# EAGLE schematic LampBoxV0.31-THT (EAGLE 9.6.2)
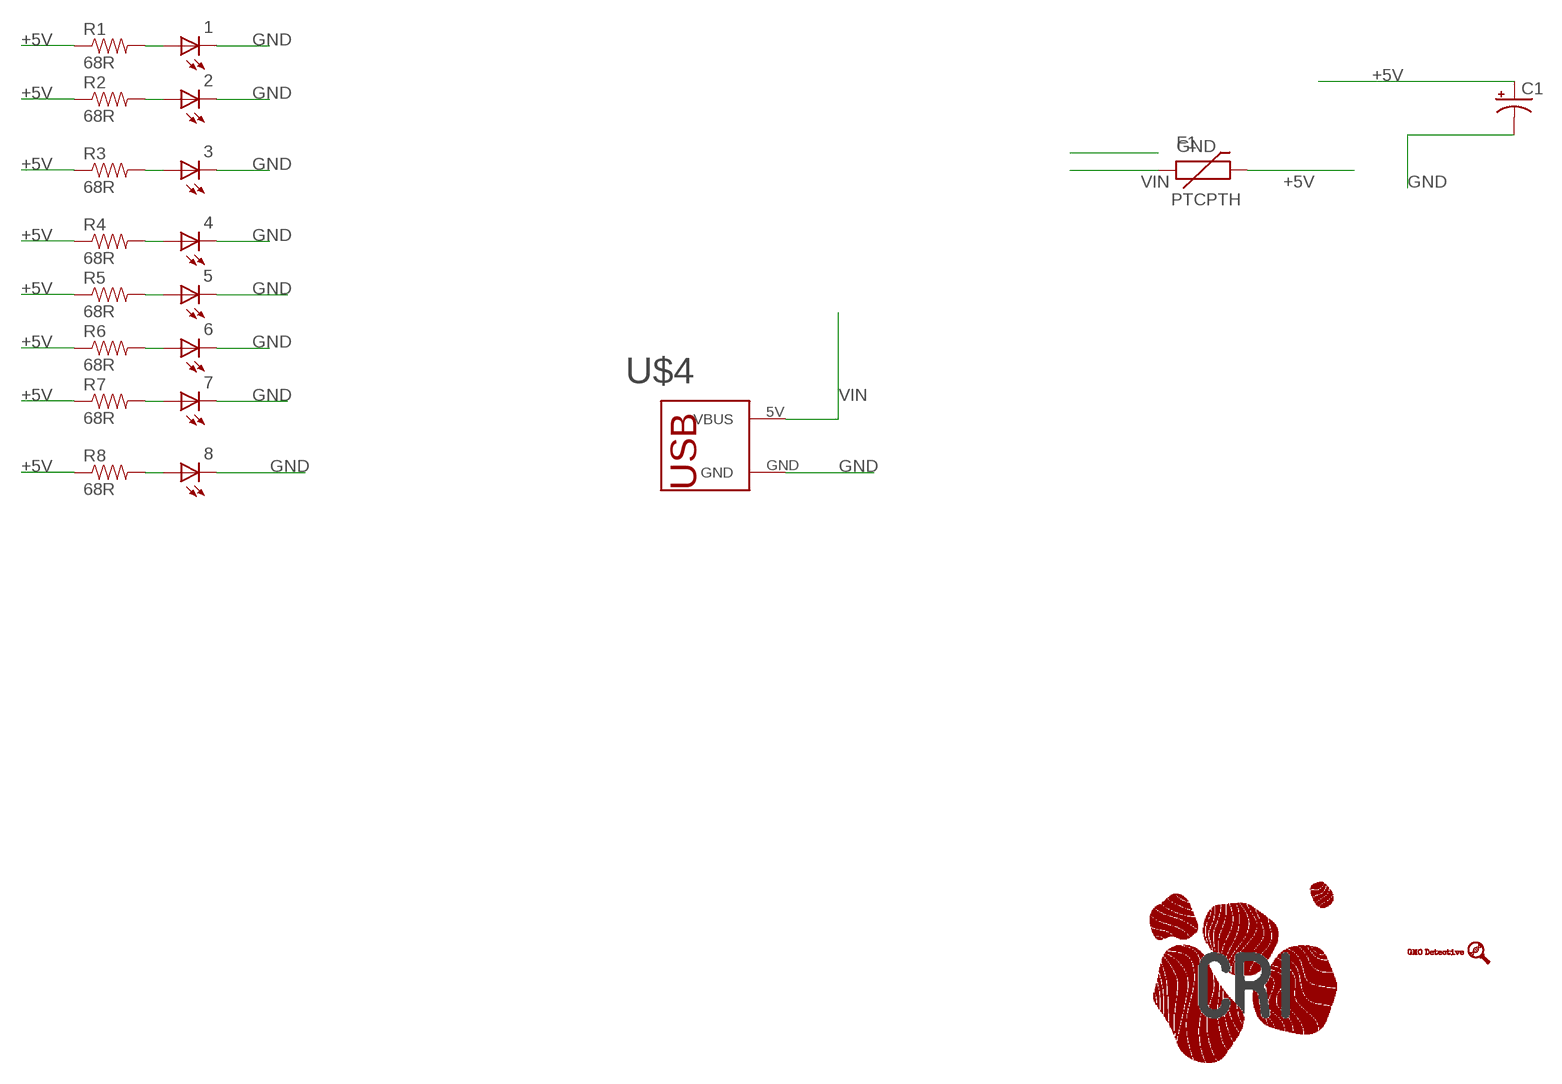
[diagram p0: schematic, sheet 1]

## Parts
1  LEDGMODETECTOR  [LED_5MM]
2  LEDGMODETECTOR  [LED_5MM]
3  LEDGMODETECTOR  [LED_5MM]
4  LEDGMODETECTOR  [LED_5MM]
5  LEDGMODETECTOR  [LED_5MM]
6  LEDGMODETECTOR  [LED_5MM]
7  LEDGMODETECTOR  [LED_5MM]
8  LEDGMODETECTOR  [LED_5MM]
C1  10UF-POLARGMODETECTOR  [CPOL-RADIAL-2.5MM-5MM]
F1  PTCPTH  [PTC]
R1  68R  RESISTORAXIAL-0.3  [AXIAL-0.3]
R2  68R  RESISTORAXIAL-0.3  [AXIAL-0.3]
R3  68R  RESISTORAXIAL-0.3  [AXIAL-0.3]
R4  68R  RESISTORAXIAL-0.3  [AXIAL-0.3]
R5  68R  RESISTORAXIAL-0.3  [AXIAL-0.3]
R6  68R  RESISTORAXIAL-0.3  [AXIAL-0.3]
R7  68R  RESISTORAXIAL-0.3  [AXIAL-0.3]
R8  68R  RESISTORAXIAL-0.3  [AXIAL-0.3]
U$2  LOGO_GMO_DETECTIVENEW  [LOGO_GMO_DETECTIVE]
U$3  LOGO-CRI-NEW-110MM-BOTTOM-SILK  [LOGO_CRI-NEW-BMP10MM-BOTTOM]
U$4  USB-2P  [MICRO-USB2P-TB1]

## Nets
+5V: C1.1(+) F1.P$2 R1.P$1 R2.P$1 R3.P$1 R4.P$1 R5.P$1 R6.P$1 R7.P$1 R8.P$1
GND: 1.K(C) 2.K(C) 3.K(C) 4.K(C) 5.K(C) 6.K(C) 7.K(C) 8.K(C) C1.2(-) U$4.GND
N$2: 1.A R1.P$2
N$5: 2.A R2.P$2
N$13: 3.A R3.P$2
N$14: 4.A R4.P$2
N$15: 5.A R5.P$2
N$16: 6.A R6.P$2
N$17: 7.A R7.P$2
N$18: 8.A R8.P$2
VIN: F1.P$1 U$4.5V(VBUS)

## Library data of the parts
1-8 = movuino:LED: LEDs 5mm Blue LED for GMO Detector; MPN: C503B-BAN-CZ0A0451; OC_MOUSER: 941-C503BBANCZ0A0451
C1 = movuino:10UF-POLAR: 10.0µF polarized capacitors A capacitor is a passive two-terminal electrical component used to store electrical energy temporarily in an electric field.; MPN: ECA-1JM100B; OC_MOUSER: 667-ECA-1JM100B
F1 = movuino:PTC: Resettable Fuse PTC Resettable Fuse. Spark Fun Electronics SKU : COM-08357
R1-R8 = movuino:RESISTOR: Resistor Basic schematic elements and footprints for 0402 , 0603, 1206, and PTH resistors.
U$2 = movuino_aestheticsV0:LOGO_GMO_DETECTIVE
U$3 = movuino_aestheticsV0:LOGO-CRI-NEW-1
U$4 = movuino:USB-2P